# Altium schematic sheet rgb_led.SchDoc
size A4; Engineer: Amir Hossein Jobeiri; Organization: Simaran; SheetNumber: 17; SheetTotal: 24
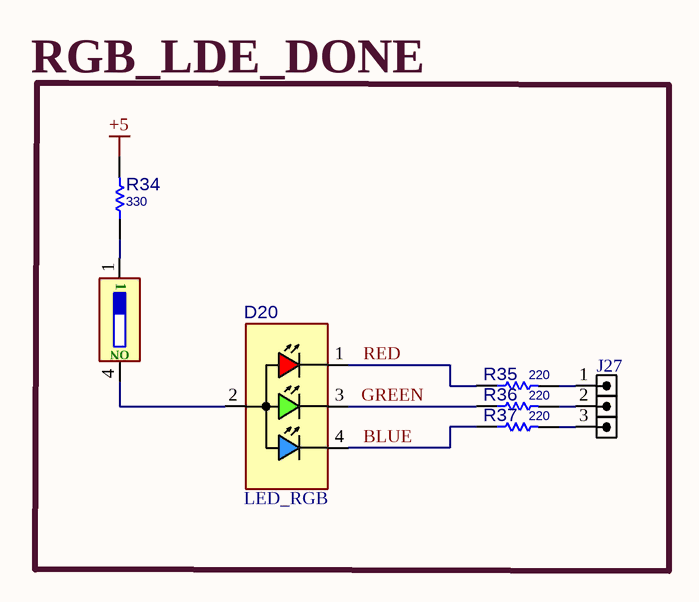
[diagram p0: rgb_led.SchDoc]

## Parts
D20  LED_RGB  [LED5RGB]
J27  HDRM3  [HDR_M_1X3]  (value not drawn)
R34  330  [R025W_AX04]
R35  220  [R025W_AX04]
R36  220  [R025W_AX04]
R37  220  [R025W_AX04]
S3  DIPSW12  [DIPSW254T_1]  (value not drawn)  (part A of 12)

## Blocks framed on the sheet
RGB_LDE_DONE: D20 J27 R34-R37 S3

## Nets
+5: R34.2
BLUE: D20.4(BLU) R37.1
GREEN: D20.3(GRN) R36.1
RED: D20.1(RED) R35.1
NetD20_2: D20.2(C) S3.4(B1)
NetJ27_1: J27.1 R35.2
NetJ27_2: J27.2 R36.2
NetJ27_3: J27.3 R37.2
NetR34_1: R34.1 S3.1(A1)

## Notes on the sheet
- (in symbol DIPSW254T_12P, part A) ON

## Library data of the parts
D20 = LED_THD_5MM_RGB_CA: LED, THD, 5MM, RGB COMMON CATHODE; MANF_P#: YSL-R596CR3G4B5C-C10; MANF: CHINA YOUNG; DESC: DESCRIPTION; ASSEMBLY: ASSEMBLY; PRICE: PRICE; VALUE: LED_RGB
J27 = HDR_M_1X3: CONN, HEADER, Male, pitch: 2.54mm, 3POS; VALUE: HDRM3
R34-R37 = RES_THD: RESISTOR, THD; MANF_P#: RK73H1ETTP4701F; MANF: KOA SPEER; PARAM: 0.063W; DESC: DESCRIPTION; DIST#: MOUSER; PARAM2: 1%; ASSEMBLY: ASSEMBLY; PRICE: 100= 0.5$
  R34: VALUE: 330
  R35-R37: VALUE: 220
S3 = DIPSW254T_12P: SWITCH, DIP, 12P, THD; MANF: MANF; MANF_P#: MANF_P#; VALUE: DIPSW12